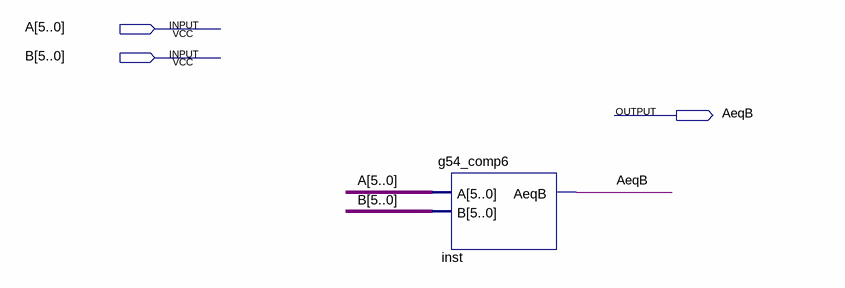
[diagram p0: schematic sheet]
// Quartus schematic g54_comp6Block.bdf as structural Verilog: 1 symbols, 3 pins
module g54_comp6Block (
  input  [5:0] A,
  input  [5:0] B,
  output AeqB
);

  g54_comp6 inst (.A(A), .B(B), .AeqB(AeqB));
endmodule
